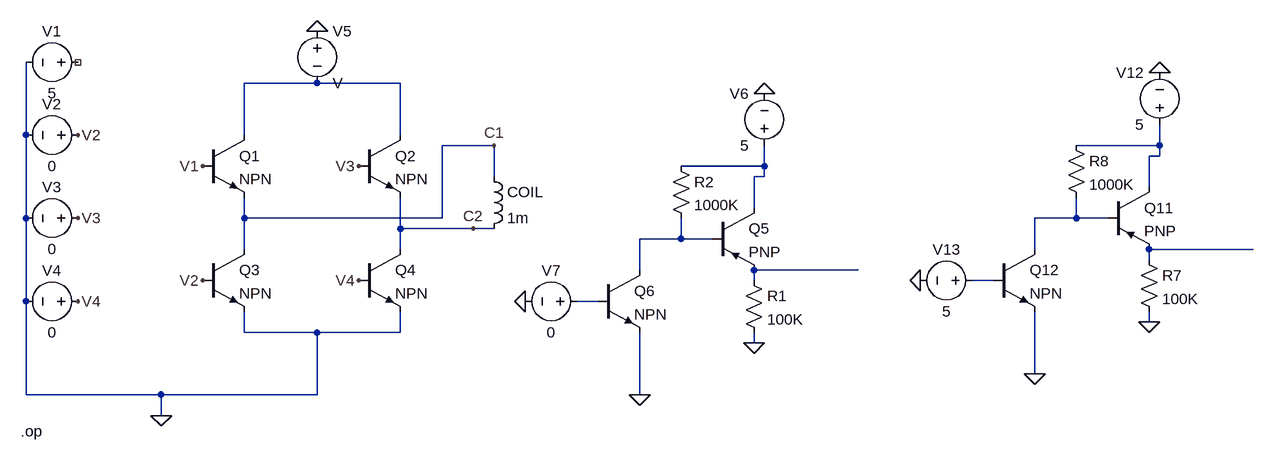
[diagram p0: schematic acionamentos stepmotor.asc]
acionamentos stepmotor.asc, the LTspice schematic file:
Version 4
SHEET 1 2728 680
WIRE 32 -48 -80 -48
WIRE 160 -48 32 -48
WIRE -416 32 -416 -80
WIRE -80 32 -80 -48
WIRE 160 32 160 -48
WIRE 304 48 224 48
WIRE 1328 48 1328 16
WIRE 1328 48 1200 48
WIRE 1328 64 1328 48
WIRE 1328 64 1312 64
WIRE 720 80 720 48
WIRE 720 80 592 80
WIRE 304 96 304 48
WIRE 720 96 720 80
WIRE 720 96 704 96
WIRE 1312 112 1312 64
WIRE 704 144 704 96
WIRE -416 160 -416 32
WIRE -80 160 -80 128
WIRE 224 160 224 48
WIRE 224 160 -80 160
WIRE 1200 160 1200 128
WIRE 1200 160 1136 160
WIRE 1248 160 1200 160
WIRE 160 176 160 128
WIRE 272 176 160 176
WIRE 304 176 272 176
WIRE 592 192 592 160
WIRE 592 192 528 192
WIRE 640 192 592 192
WIRE -80 208 -80 160
WIRE 160 208 160 176
WIRE 1136 208 1136 160
WIRE 1472 208 1312 208
WIRE 1312 224 1312 208
WIRE 528 240 528 192
WIRE 864 240 704 240
WIRE 704 256 704 240
WIRE 1072 256 1040 256
WIRE -416 288 -416 160
WIRE 464 288 432 288
WIRE 1312 320 1312 304
WIRE -80 336 -80 304
WIRE 32 336 -80 336
WIRE 160 336 160 304
WIRE 160 336 32 336
WIRE 704 352 704 336
WIRE 1136 400 1136 304
WIRE -416 432 -416 288
WIRE -208 432 -416 432
WIRE 32 432 32 336
WIRE 32 432 -208 432
WIRE 528 432 528 336
WIRE -208 464 -208 432
FLAG -144 80 V1
FLAG -144 256 V2
FLAG 96 80 V3
FLAG 96 256 V4
FLAG 32 -128 0
FLAG -208 464 0
FLAG -336 32 V2
FLAG -336 160 V3
FLAG -336 288 V4
FLAG 304 48 C1
FLAG 272 176 C2
FLAG 704 352 0
FLAG 720 -32 0
FLAG 528 432 0
FLAG 352 288 0
FLAG 1312 320 0
FLAG 1328 -64 0
FLAG 1136 400 0
FLAG 960 256 0
DATAFLAG 848 240 ""
DATAFLAG 1456 208 ""
SYMBOL ind 288 80 R0
SYMATTR InstName COIL
SYMATTR Value 1m
SYMBOL npn -144 32 R0
SYMATTR InstName Q1
SYMBOL npn 96 32 R0
SYMATTR InstName Q2
SYMBOL npn -144 208 R0
SYMATTR InstName Q3
SYMBOL npn 96 208 R0
SYMATTR InstName Q4
SYMBOL voltage -320 32 R90
WINDOW 0 -32 56 VBottom 2
WINDOW 3 32 56 VTop 2
WINDOW 123 0 0 Left 0
WINDOW 39 0 0 Left 0
SYMATTR InstName V2
SYMATTR Value 0
SYMBOL voltage -320 160 R90
WINDOW 0 -32 56 VBottom 2
WINDOW 3 32 56 VTop 2
WINDOW 123 0 0 Left 0
WINDOW 39 0 0 Left 0
SYMATTR InstName V3
SYMATTR Value 0
SYMBOL voltage -320 288 R90
WINDOW 0 -32 56 VBottom 2
WINDOW 3 32 56 VTop 2
WINDOW 123 0 0 Left 0
WINDOW 39 0 0 Left 0
SYMATTR InstName V4
SYMATTR Value 0
SYMBOL voltage -320 -80 R90
WINDOW 0 -32 56 VBottom 2
WINDOW 3 32 56 VTop 2
WINDOW 123 0 0 Left 0
WINDOW 39 0 0 Left 0
SYMATTR InstName V1
SYMATTR Value 5
SYMBOL voltage 32 -144 R0
SYMATTR InstName V5
SYMBOL pnp 640 144 R0
SYMATTR InstName Q5
SYMBOL res 688 240 R0
SYMATTR InstName R1
SYMATTR Value 100K
SYMBOL voltage 720 64 R180
WINDOW 0 24 96 Left 2
WINDOW 3 24 16 Left 2
WINDOW 123 0 0 Left 0
WINDOW 39 0 0 Left 0
SYMATTR InstName V6
SYMATTR Value 5
SYMBOL npn 464 240 R0
SYMATTR InstName Q6
SYMBOL res 576 64 R0
SYMATTR InstName R2
SYMATTR Value 1000K
SYMBOL voltage 448 288 R90
WINDOW 0 -32 56 VBottom 2
WINDOW 3 32 56 VTop 2
WINDOW 123 0 0 Left 0
WINDOW 39 0 0 Left 0
SYMATTR InstName V7
SYMATTR Value 0
SYMBOL pnp 1248 112 R0
SYMATTR InstName Q11
SYMBOL res 1296 208 R0
SYMATTR InstName R7
SYMATTR Value 100K
SYMBOL voltage 1328 32 R180
WINDOW 0 24 96 Left 2
WINDOW 3 24 16 Left 2
WINDOW 123 0 0 Left 0
WINDOW 39 0 0 Left 0
SYMATTR InstName V12
SYMATTR Value 5
SYMBOL npn 1072 208 R0
SYMATTR InstName Q12
SYMBOL res 1184 32 R0
SYMATTR InstName R8
SYMATTR Value 1000K
SYMBOL voltage 1056 256 R90
WINDOW 0 -32 56 VBottom 2
WINDOW 3 32 56 VTop 2
WINDOW 123 0 0 Left 0
WINDOW 39 0 0 Left 0
SYMATTR InstName V13
SYMATTR Value 5
TEXT -424 488 Left 2 !.op

The netlist it stands for:
* acionamentos stepmotor.asc
L§COIL C1 C2 1m
Q1 N001 V1 C1 0 NPN
Q2 N001 V3 C2 0 NPN
Q3 C1 V2 0 0 NPN
Q4 C2 V4 0 0 NPN
V2 V2 0 0
V3 V3 0 0
V4 V4 0 0
V1 NC_01 0 5
V5 0 N001 V
Q5 N003 N005 N007 0 PNP
R1 N007 0 100K
V6 N003 0 5
Q6 N005 N009 0 0 NPN
R2 N003 N005 1000K
V7 N009 0 0
Q11 N002 N004 N006 0 PNP
R7 N006 0 100K
V12 N002 0 5
Q12 N004 N008 0 0 NPN
R8 N002 N004 1000K
V13 N008 0 5
.model NPN NPN
.model PNP PNP
.lib standard.bjt
.op
.backanno
.end